# EAGLE design TPS (EAGLE 9.6.2)
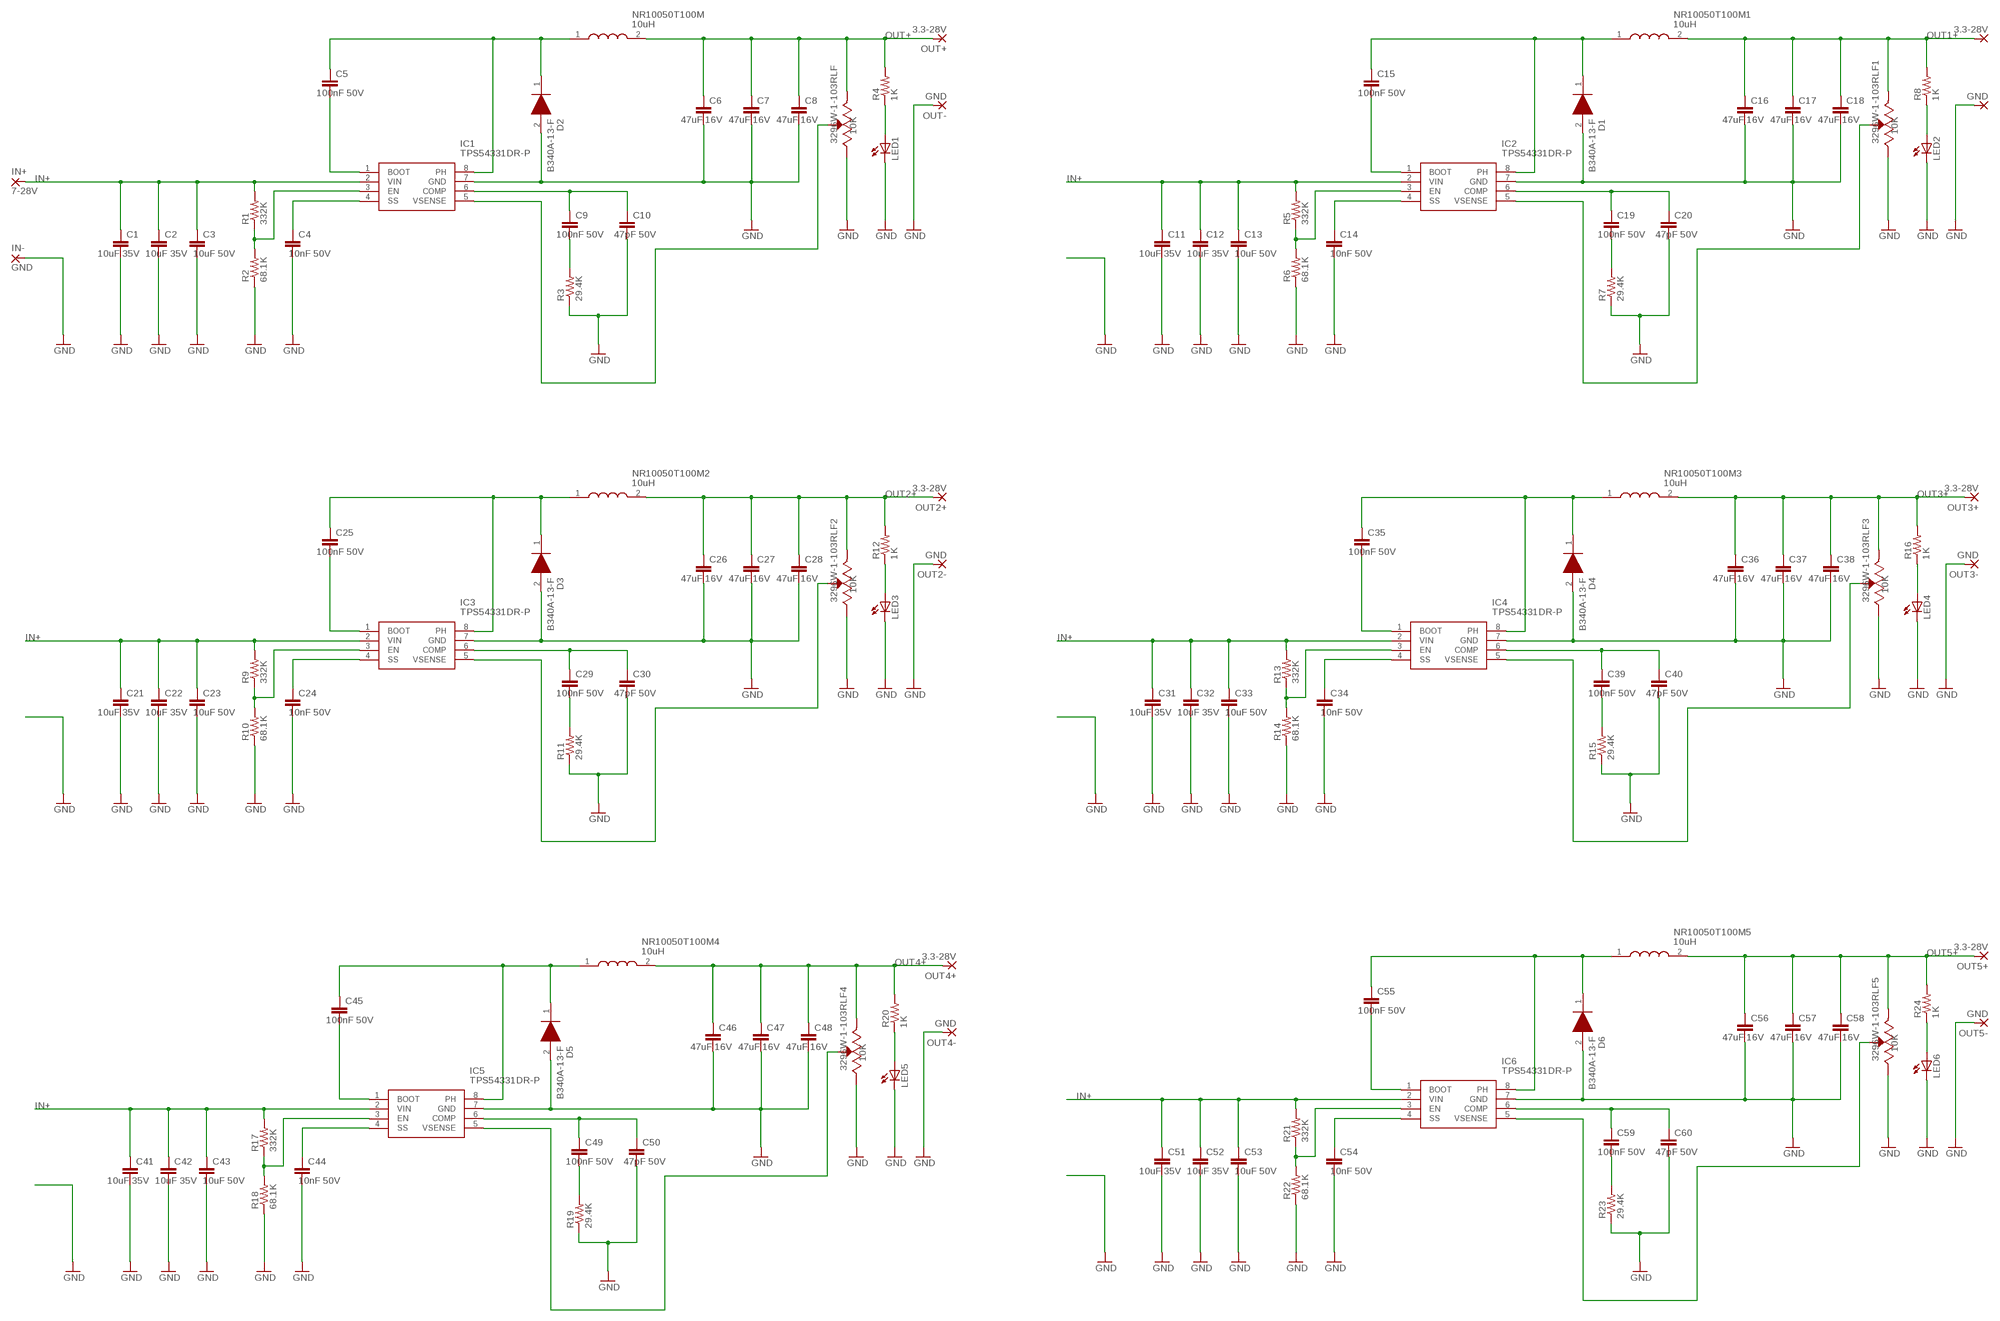
[diagram p0: schematic, sheet 1]

## Parts
3296W-1-103RLF  10K  3296W-1-103RLF  [TRIM_3296W-1-103RLF]
3296W-1-103RLF1  10K  3296W-1-103RLF  [TRIM_3296W-1-103RLF]
3296W-1-103RLF2  10K  3296W-1-103RLF  [TRIM_3296W-1-103RLF]
3296W-1-103RLF3  10K  3296W-1-103RLF  [TRIM_3296W-1-103RLF]
3296W-1-103RLF4  10K  3296W-1-103RLF  [TRIM_3296W-1-103RLF]
3296W-1-103RLF5  10K  3296W-1-103RLF  [TRIM_3296W-1-103RLF]
C1  10uF 35V  SPARKFUN_CAP1206  [SPARKFUN_1206]
C2  10uF 35V  SPARKFUN_CAP1206  [SPARKFUN_1206]
C3  10uF 50V  CAP1206  [1206]
C4  10nF 50V  SPARKFUN_CAP1206  [SPARKFUN_1206]
C5  100nF 50V  SPARKFUN_CAP1206  [SPARKFUN_1206]
C6  47uF 16V  SPARKFUN_CAP1206  [SPARKFUN_1206]
C7  47uF 16V  SPARKFUN_CAP1206  [SPARKFUN_1206]
C8  47uF 16V  SPARKFUN_CAP1206  [SPARKFUN_1206]
C9  100nF 50V  SPARKFUN_CAP1206  [SPARKFUN_1206]
C10  47pF 50V  SPARKFUN_CAP1206  [SPARKFUN_1206]
C11  10uF 35V  SPARKFUN_CAP1206  [SPARKFUN_1206]
C12  10uF 35V  SPARKFUN_CAP1206  [SPARKFUN_1206]
C13  10uF 50V  CAP1206  [1206]
C14  10nF 50V  SPARKFUN_CAP1206  [SPARKFUN_1206]
C15  100nF 50V  SPARKFUN_CAP1206  [SPARKFUN_1206]
C16  47uF 16V  SPARKFUN_CAP1206  [SPARKFUN_1206]
C17  47uF 16V  SPARKFUN_CAP1206  [SPARKFUN_1206]
C18  47uF 16V  SPARKFUN_CAP1206  [SPARKFUN_1206]
C19  100nF 50V  SPARKFUN_CAP1206  [SPARKFUN_1206]
C20  47pF 50V  SPARKFUN_CAP1206  [SPARKFUN_1206]
C21  10uF 35V  SPARKFUN_CAP1206  [SPARKFUN_1206]
C22  10uF 35V  SPARKFUN_CAP1206  [SPARKFUN_1206]
C23  10uF 50V  CAP1206  [1206]
C24  10nF 50V  SPARKFUN_CAP1206  [SPARKFUN_1206]
C25  100nF 50V  SPARKFUN_CAP1206  [SPARKFUN_1206]
C26  47uF 16V  SPARKFUN_CAP1206  [SPARKFUN_1206]
C27  47uF 16V  SPARKFUN_CAP1206  [SPARKFUN_1206]
C28  47uF 16V  SPARKFUN_CAP1206  [SPARKFUN_1206]
C29  100nF 50V  SPARKFUN_CAP1206  [SPARKFUN_1206]
C30  47pF 50V  SPARKFUN_CAP1206  [SPARKFUN_1206]
C31  10uF 35V  SPARKFUN_CAP1206  [SPARKFUN_1206]
C32  10uF 35V  SPARKFUN_CAP1206  [SPARKFUN_1206]
C33  10uF 50V  CAP1206  [1206]
C34  10nF 50V  SPARKFUN_CAP1206  [SPARKFUN_1206]
C35  100nF 50V  SPARKFUN_CAP1206  [SPARKFUN_1206]
C36  47uF 16V  SPARKFUN_CAP1206  [SPARKFUN_1206]
C37  47uF 16V  SPARKFUN_CAP1206  [SPARKFUN_1206]
C38  47uF 16V  SPARKFUN_CAP1206  [SPARKFUN_1206]
C39  100nF 50V  SPARKFUN_CAP1206  [SPARKFUN_1206]
C40  47pF 50V  SPARKFUN_CAP1206  [SPARKFUN_1206]
C41  10uF 35V  SPARKFUN_CAP1206  [SPARKFUN_1206]
C42  10uF 35V  SPARKFUN_CAP1206  [SPARKFUN_1206]
C43  10uF 50V  CAP1206  [1206]
C44  10nF 50V  SPARKFUN_CAP1206  [SPARKFUN_1206]
C45  100nF 50V  SPARKFUN_CAP1206  [SPARKFUN_1206]
C46  47uF 16V  SPARKFUN_CAP1206  [SPARKFUN_1206]
C47  47uF 16V  SPARKFUN_CAP1206  [SPARKFUN_1206]
C48  47uF 16V  SPARKFUN_CAP1206  [SPARKFUN_1206]
C49  100nF 50V  SPARKFUN_CAP1206  [SPARKFUN_1206]
C50  47pF 50V  SPARKFUN_CAP1206  [SPARKFUN_1206]
C51  10uF 35V  SPARKFUN_CAP1206  [SPARKFUN_1206]
C52  10uF 35V  SPARKFUN_CAP1206  [SPARKFUN_1206]
C53  10uF 50V  CAP1206  [1206]
C54  10nF 50V  SPARKFUN_CAP1206  [SPARKFUN_1206]
C55  100nF 50V  SPARKFUN_CAP1206  [SPARKFUN_1206]
C56  47uF 16V  SPARKFUN_CAP1206  [SPARKFUN_1206]
C57  47uF 16V  SPARKFUN_CAP1206  [SPARKFUN_1206]
C58  47uF 16V  SPARKFUN_CAP1206  [SPARKFUN_1206]
C59  100nF 50V  SPARKFUN_CAP1206  [SPARKFUN_1206]
C60  47pF 50V  SPARKFUN_CAP1206  [SPARKFUN_1206]
D1  B340A-13-F  [DIOM5226X240N]
D2  B340A-13-F  [DIOM5226X240N]
D3  B340A-13-F  [DIOM5226X240N]
D4  B340A-13-F  [DIOM5226X240N]
D5  B340A-13-F  [DIOM5226X240N]
D6  B340A-13-F  [DIOM5226X240N]
IC1  TPS54331DR-P  [SOIC127P600X175-8N]
IC2  TPS54331DR-P  [SOIC127P600X175-8N]
IC3  TPS54331DR-P  [SOIC127P600X175-8N]
IC4  TPS54331DR-P  [SOIC127P600X175-8N]
IC5  TPS54331DR-P  [SOIC127P600X175-8N]
IC6  TPS54331DR-P  [SOIC127P600X175-8N]
IN+  7-28V  WIREPADSMD5-2,5  [5-2,5]
IN-  GND  WIREPAD3,81/1,4  [3,81/1,4]
LED1  SPARKFUN_LED1206  [SPARKFUN_LED-1206]
LED2  SPARKFUN_LED1206  [SPARKFUN_LED-1206]
LED3  SPARKFUN_LED1206  [SPARKFUN_LED-1206]
LED4  SPARKFUN_LED1206  [SPARKFUN_LED-1206]
LED5  SPARKFUN_LED1206  [SPARKFUN_LED-1206]
LED6  SPARKFUN_LED1206  [SPARKFUN_LED-1206]
NR10050T100M  10uH  NR10050T100M  [NR10050T100M]
NR10050T100M1  10uH  NR10050T100M  [NR10050T100M]
NR10050T100M2  10uH  NR10050T100M  [NR10050T100M]
NR10050T100M3  10uH  NR10050T100M  [NR10050T100M]
NR10050T100M4  10uH  NR10050T100M  [NR10050T100M]
NR10050T100M5  10uH  NR10050T100M  [NR10050T100M]
OUT1+  3.3-28V  WIREPADSMD5-2,5  [5-2,5]
OUT1-  GND  WIREPAD3,81/1,4  [3,81/1,4]
OUT2+  3.3-28V  WIREPADSMD5-2,5  [5-2,5]
OUT2-  GND  WIREPAD3,81/1,4  [3,81/1,4]
OUT3+  3.3-28V  WIREPADSMD5-2,5  [5-2,5]
OUT3-  GND  WIREPAD3,81/1,4  [3,81/1,4]
OUT4+  3.3-28V  WIREPADSMD5-2,5  [5-2,5]
OUT4-  GND  WIREPAD3,81/1,4  [3,81/1,4]
OUT5+  3.3-28V  WIREPADSMD5-2,5  [5-2,5]
OUT5-  GND  WIREPAD3,81/1,4  [3,81/1,4]
OUT+  3.3-28V  WIREPADSMD5-2,5  [5-2,5]
OUT-  GND  WIREPAD3,81/1,4  [3,81/1,4]
R1  332K  R-US_M1206  [M1206]
R2  68.1K  R-US_M1206  [M1206]
R3  29.4K  R-US_M1206  [M1206]
R4  1K  R-US_M1206  [M1206]
R5  332K  R-US_M1206  [M1206]
R6  68.1K  R-US_M1206  [M1206]
R7  29.4K  R-US_M1206  [M1206]
R8  1K  R-US_M1206  [M1206]
R9  332K  R-US_M1206  [M1206]
R10  68.1K  R-US_M1206  [M1206]
R11  29.4K  R-US_M1206  [M1206]
R12  1K  R-US_M1206  [M1206]
R13  332K  R-US_M1206  [M1206]
R14  68.1K  R-US_M1206  [M1206]
R15  29.4K  R-US_M1206  [M1206]
R16  1K  R-US_M1206  [M1206]
R17  332K  R-US_M1206  [M1206]
R18  68.1K  R-US_M1206  [M1206]
R19  29.4K  R-US_M1206  [M1206]
R20  1K  R-US_M1206  [M1206]
R21  332K  R-US_M1206  [M1206]
R22  68.1K  R-US_M1206  [M1206]
R23  29.4K  R-US_M1206  [M1206]
R24  1K  R-US_M1206  [M1206]

## Nets
GND: 3296W-1-103RLF1.1(CCW) 3296W-1-103RLF2.1(CCW) 3296W-1-103RLF3.1(CCW) 3296W-1-103RLF4.1(CCW) 3296W-1-103RLF5.1(CCW) 3296W-1-103RLF.1(CCW) C1.2 C2.2 C3.2 C4.2 C6.2 C7.2 C8.2 C10.2 C11.2 C12.2 C13.2 C14.2 C16.2 C17.2 C18.2 C20.2 C21.2 C22.2 C23.2 C24.2 C26.2 C27.2 C28.2 C30.2 C31.2 C32.2 C33.2 C34.2 C36.2 C37.2 C38.2 C40.2 C41.2 C42.2 C43.2 C44.2 C46.2 C47.2 C48.2 C50.2 C51.2 C52.2 C53.2 C54.2 C56.2 C57.2 C58.2 C60.2 D1.2(A) D2.2(A) D3.2(A) D4.2(A) D5.2(A) D6.2(A) IC1.7(GND) IC2.7(GND) IC3.7(GND) IC4.7(GND) IC5.7(GND) IC6.7(GND) IN-.1(P) LED1.C LED2.C LED3.C LED4.C LED5.C LED6.C OUT1-.1(P) OUT2-.1(P) OUT3-.1(P) OUT4-.1(P) OUT5-.1(P) OUT-.1(P) R2.1 R3.1 R6.1 R7.1 R10.1 R11.1 R14.1 R15.1 R18.1 R19.1 R22.1 R23.1
IN+: C1.1 C2.1 C3.1 C11.1 C12.1 C13.1 C21.1 C22.1 C23.1 C31.1 C32.1 C33.1 C41.1 C42.1 C43.1 C51.1 C52.1 C53.1 IC1.2(VIN) IC2.2(VIN) IC3.2(VIN) IC4.2(VIN) IC5.2(VIN) IC6.2(VIN) IN+.1(P) R1.2 R5.2 R9.2 R13.2 R17.2 R21.2
N$1: IC1.3(EN) R1.1 R2.2
N$3: C4.1 IC1.4(SS)
N$4: C5.2 IC1.1(BOOT)
N$5: C5.1 D2.1(K) IC1.8(PH) NR10050T100M.1
N$6: C9.1 C10.1 IC1.6(COMP)
N$8: C9.2 R3.2
N$9: IC2.3(EN) R5.1 R6.2
N$10: LED1.A R4.1
N$11: 3296W-1-103RLF.2(WIPER) IC1.5(VSENSE)
N$13: C14.1 IC2.4(SS)
N$14: C15.2 IC2.1(BOOT)
N$15: C15.1 D1.1(K) IC2.8(PH) NR10050T100M1.1
N$17: C19.1 C20.1 IC2.6(COMP)
N$18: C19.2 R7.2
N$19: LED2.A R8.1
N$20: 3296W-1-103RLF1.2(WIPER) IC2.5(VSENSE)
N$21: IC3.3(EN) R9.1 R10.2
N$23: C24.1 IC3.4(SS)
N$24: C25.2 IC3.1(BOOT)
N$25: C25.1 D3.1(K) IC3.8(PH) NR10050T100M2.1
N$27: C29.1 C30.1 IC3.6(COMP)
N$28: C29.2 R11.2
N$29: LED3.A R12.1
N$30: 3296W-1-103RLF2.2(WIPER) IC3.5(VSENSE)
N$31: IC4.3(EN) R13.1 R14.2
N$33: C34.1 IC4.4(SS)
N$34: C35.2 IC4.1(BOOT)
N$35: C35.1 D4.1(K) IC4.8(PH) NR10050T100M3.1
N$37: C39.1 C40.1 IC4.6(COMP)
N$38: C39.2 R15.2
N$39: LED4.A R16.1
N$40: 3296W-1-103RLF3.2(WIPER) IC4.5(VSENSE)
N$41: IC5.3(EN) R17.1 R18.2
N$43: C44.1 IC5.4(SS)
N$44: C45.2 IC5.1(BOOT)
N$45: C45.1 D5.1(K) IC5.8(PH) NR10050T100M4.1
N$47: C49.1 C50.1 IC5.6(COMP)
N$48: C49.2 R19.2
N$49: LED5.A R20.1
N$50: 3296W-1-103RLF4.2(WIPER) IC5.5(VSENSE)
N$51: IC6.3(EN) R21.1 R22.2
N$53: C54.1 IC6.4(SS)
N$54: C55.2 IC6.1(BOOT)
N$55: C55.1 D6.1(K) IC6.8(PH) NR10050T100M5.1
N$57: C59.1 C60.1 IC6.6(COMP)
N$58: C59.2 R23.2
N$59: LED6.A R24.1
N$60: 3296W-1-103RLF5.2(WIPER) IC6.5(VSENSE)
OUT1+: 3296W-1-103RLF1.3(CW) C16.1 C17.1 C18.1 NR10050T100M1.2 OUT1+.1(P) R8.2
OUT2+: 3296W-1-103RLF2.3(CW) C26.1 C27.1 C28.1 NR10050T100M2.2 OUT2+.1(P) R12.2
OUT3+: 3296W-1-103RLF3.3(CW) C36.1 C37.1 C38.1 NR10050T100M3.2 OUT3+.1(P) R16.2
OUT4+: 3296W-1-103RLF4.3(CW) C46.1 C47.1 C48.1 NR10050T100M4.2 OUT4+.1(P) R20.2
OUT5+: 3296W-1-103RLF5.3(CW) C56.1 C57.1 C58.1 NR10050T100M5.2 OUT5+.1(P) R24.2
OUT+: 3296W-1-103RLF.3(CW) C6.1 C7.1 C8.1 NR10050T100M.2 OUT+.1(P) R4.2

## Library data of the parts
3296W-1-103RLF 3296W-1-103RLF1-3296W-1-103RLF5 = 3296W-1-103RLF:3296W-1-103RLF: Res Cermet Trimmer 500K Ohm 10% 0.5W 25(Elec)Turn 2.19mm (9.53 X 4.83 X 11.55mm) Pin Thru-Hole Tube Check prices <https://pricing.snapeda.com/parts/3296W-1-103RLF/Bourns/view-part?ref=eda>; AVAILABILITY: In Stock; DESCRIPTION: 10 kOhms 0.5W, 1/2W PC Pins Through Hole Trimmer Potentiometer Cermet 25 Turn Top Adjustment; MF: Bourns; MP: 3296W-1-103RLF; PACKAGE: SOT-23-5 Bourns; PRICE: None; PURCHASE-URL: https://pricing.snapeda.com/search/part/3296W-1-103RLF/?ref=eda
C1 C2 C4-C12 C14-C22 C24-C32 C34-C42 C44-C52 C54-C60 = DECADE-libraries20151104:SPARKFUN_CAP: Capacitor Standard 0603 ceramic capacitor, and 0.1" leaded capacitor.
C3 C13 C23 C33 C43 C53 = SparkFun:CAP: Capacitor Standard 0603 ceramic capacitor, and 0.1" leaded capacitor.
D1-D6 = B340A-13-F:B340A-13-F: Schottky Diode 3A 40V 0.5Vf SMA Diodes Inc B340A-13-F, SMT Schottky Diode, 40V 3A, 2-Pin DO-214AC Source: Datasheet <http://www.diodes.com/_files/datasheets/ds30891.pdf>; ARROW_PART_NUMBER: B340A-13-F; ARROW_PRICE-STOCK: https://www.arrow.com/en/products/b340a-13-f/diodes-incorporated?region=nac; DESCRIPTION: Schottky Diode 3A 40V 0.5Vf SMA Diodes Inc B340A-13-F, SMT Schottky Diode, 40V 3A, 2-Pin DO-214AC; HEIGHT: 2.4mm; MANUFACTURER_NAME: Diodes Inc.; MANUFACTURER_PART_NUMBER: B340A-13-F; MOUSER_PART_NUMBER: 621-B340A-F; MOUSER_PRICE-STOCK: https://www.mouser.co.uk/ProductDetail/Diodes-Incorporated/B340A-13-F?qs=aLaTXeBcTP9fj%2FYKVo6Q1A%3D%3D
IC1-IC6 = TPS54331DR-P:TPS54331DR-P: 3.5V to 28V Input, 3A, 570kHz Step-Down Converter with Eco-mode Source: Datasheet <https://www.ti.com/lit/ds/symlink/tps54331.pdf?ts=1630984381275>; DESCRIPTION: 3.5V to 28V Input, 3A, 570kHz Step-Down Converter with Eco-mode; HEIGHT: 1.75mm; MANUFACTURER_NAME: Texas Instruments; MANUFACTURER_PART_NUMBER: TPS54331DR-P
IN+ IN- OUT1+ OUT1- OUT2+ OUT2- OUT3+ OUT3- OUT4+ OUT4- OUT5+ OUT5- OUT+ OUT- = wirepad:WIREPAD: Wire PAD connect wire on PCB
LED1-LED6 = antduino:SPARKFUN_LED: LEDs Standard schematic elements and footprints for 5mm, 3mm, 1206, and 0603 sized LEDs. 5mm - Spark Fun Electronics SKU : COM-00529 (and others)
NR10050T100M NR10050T100M1-NR10050T100M5 = NR10050T100M:NR10050T100M: NR10050T100M Source: Datasheet <https://ds.yuden.co.jp/TYCOMPAS/ut/download?pn=NRH2412T4R7MNGH &fileType=CA>; ARROW_PART_NUMBER: NR10050T100M; ARROW_PRICE-STOCK: https://www.arrow.com/en/products/nr10050t100m/taiyo-yuden; DESCRIPTION: NR10050T100M; HEIGHT: 5mm; MANUFACTURER_NAME: TAIYO YUDEN; MANUFACTURER_PART_NUMBER: NR10050T100M; MOUSER_PART_NUMBER: 963-NR10050T100M; MOUSER_PRICE-STOCK: https://www.mouser.co.uk/ProductDetail/Taiyo-Yuden/NR10050T100M?qs=PzICbMaShUe7rvK%2FGqf0eQ%3D%3D
R1-R24 = adafruit:R-US_: RESISTOR, American symbol

## Board
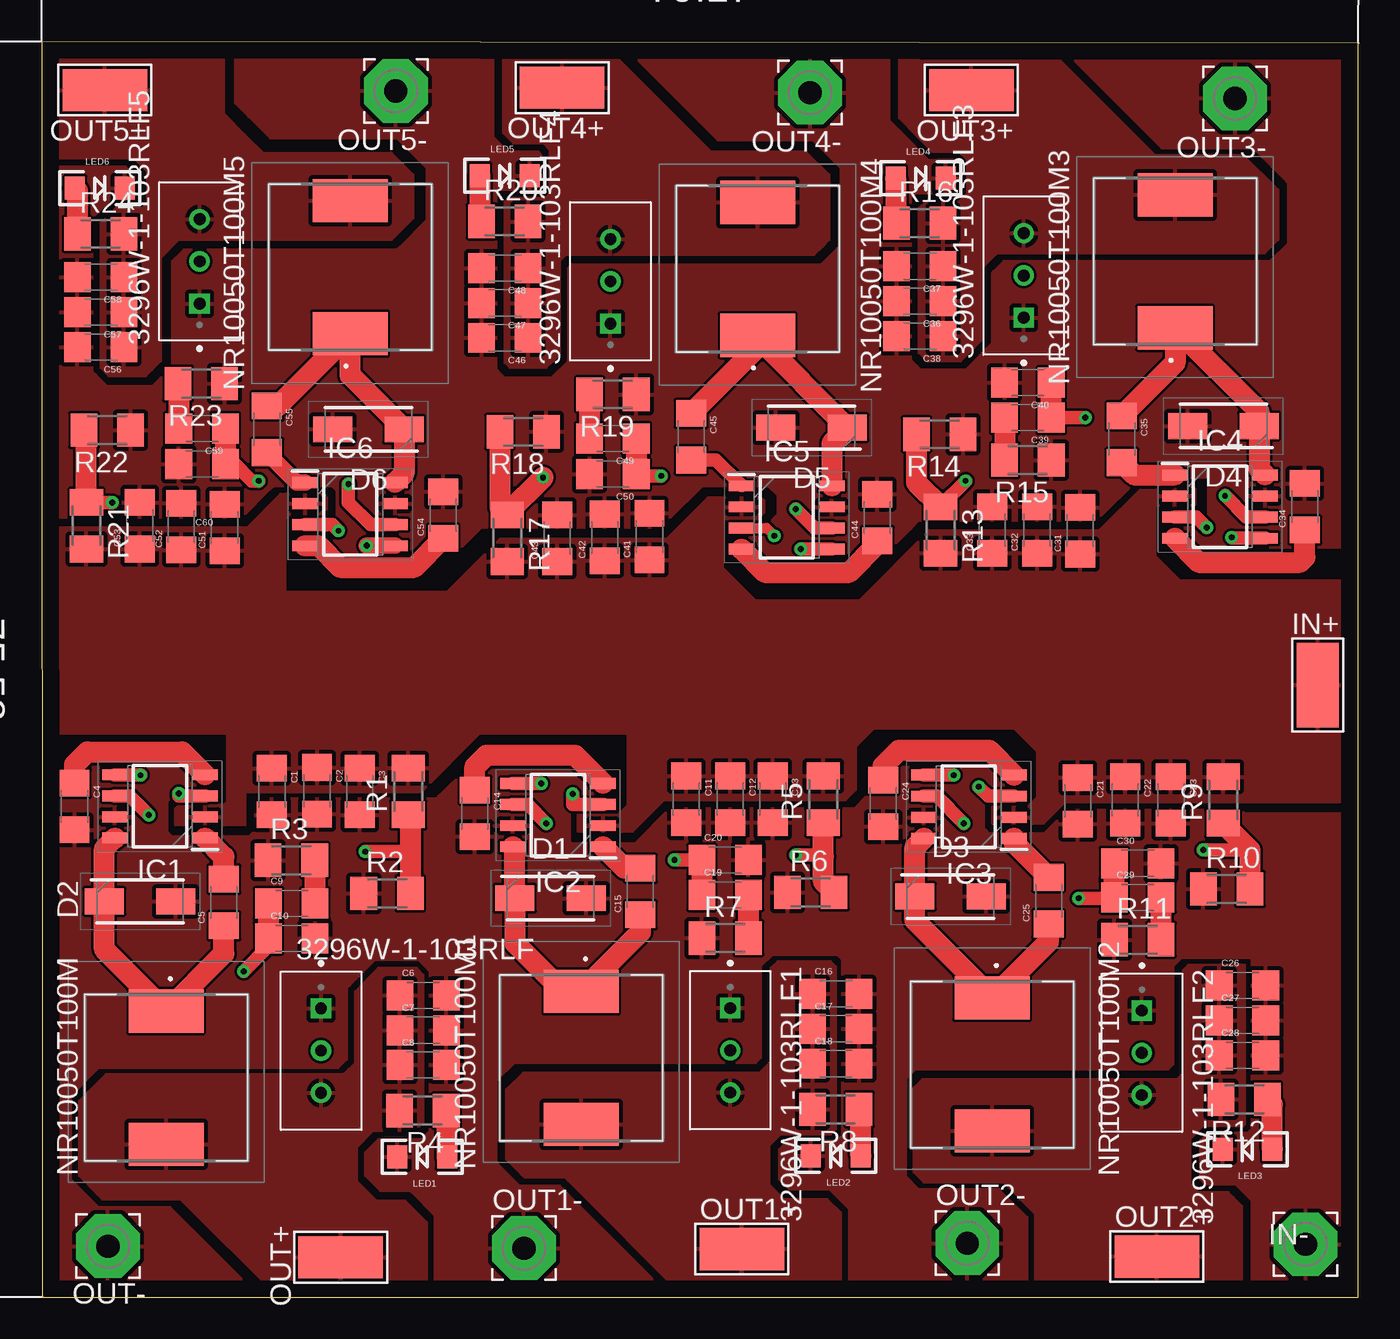
[diagram p1: board, top side]
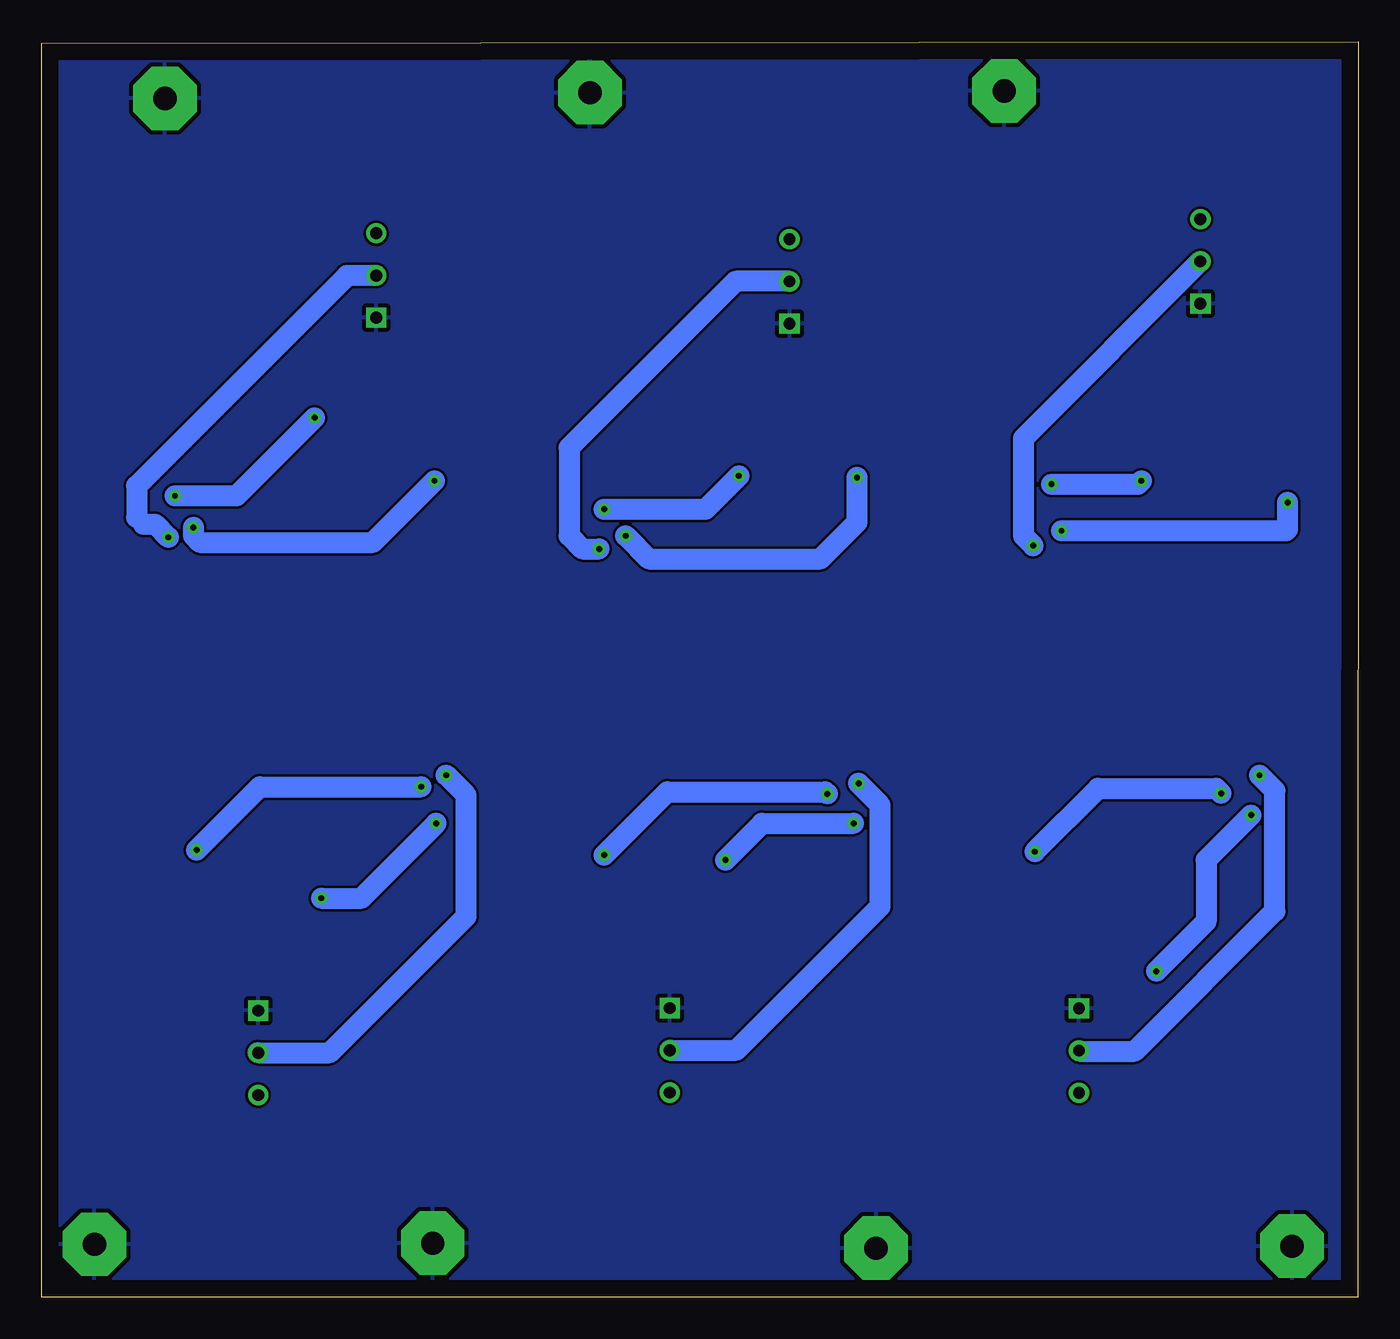
[diagram p2: board, bottom side, seen from below]

Size 79.17 x 75.52 mm. Coordinates in mm from the lower left corner, seen from the top.
Outline: 0.05,0 79.17,0 79.17,75.42 0,75.52 0.05,0
Copper layers (1*16): Top 0.035mm / dielectric 1.5mm / Bottom 0.035mm
Design rules "default": minimum track width 6mil, minimum drill 0.35mm, track to track 6mil, track to pad 6mil, pad to pad 6mil, via to via 6mil, smd to smd 6mil, copper to edge 40mil, drill to drill 6mil, minimum pad ring 10mil, minimum via ring 8mil, stop-mask expansion 4mil, vias tented up to drill 0mil, thermal gap 10mil

### Footprints (pad centres in the part's own frame; a part is rotated, then mirrored left to right if it is on the bottom)
TRIM_3296W-1-103RLF = drill 0.71 square: 1 -2.54,0 | drill 0.71: 2 0,0; 3 2.54,0
SPARKFUN_1206 = smd 1.6 x 1.8: 1 -1.4,0; 2 1.4,0
1206 = smd 1.6 x 1.8: 1 -1.4,0; 2 1.4,0
DIOM5226X240N = smd 2.35 x 1.55: 1 -2.15,0; 2 2.15,0
SOIC127P600X175-8N = smd 1.528 x 0.65: 1 -2.711,1.905; 2 -2.711,0.635; 3 -2.711,-0.635; 4 -2.711,-1.905; 5 2.711,-1.905; 6 2.711,-0.635; 7 2.711,0.635; 8 2.711,1.905
5-2,5 = smd 2.54 x 5.08: 1 0,0
3,81/1,4 = drill 1.397 pad 3.81 octagon: 1 0,0
SPARKFUN_LED-1206 = smd 1.2 x 1.4: A -1.5,0; C 1.5,0
NR10050T100M = smd 2.6 x 4.5: 1 -4,0; 2 4,0
M1206 = smd 1.6 x 2: 1 -1.4,0; 2 1.4,0

### Placement (x,y rotation side)
3296W-1-103RLF  16.8,14.83 270 top
3296W-1-103RLF1  41.4,14.85 270 top
3296W-1-103RLF2  66.15,14.7 270 top
3296W-1-103RLF3  59.05,61.45 90 top
3296W-1-103RLF4  34.2,61.1 90 top
3296W-1-103RLF5  9.5,62.3 90 top
C1  13.85,30.41 270 top
C2  16.56,30.46 270 top
C3  19.12,30.41 270 top
C4  1.98,29.51 270 top
C5  10.96,23.74 90 top
C6  22.94,18.15 0 top
C7  22.94,16.06 0 top
C8  22.94,13.97 0 top
C9  15.04,23.68 0 top
C10  15.04,21.59 0 top
C11  38.75,29.95 270 top
C12  41.4,29.95 270 top
C13  43.95,29.95 270 top
C14  26.05,29.1 270 top
C15  36,24.4 90 top
C16  47.75,18.25 0 top
C17  47.75,16.15 0 top
C18  47.75,14.05 0 top
C19  41.1,24.2 0 top
C20  41.1,26.3 0 top
C21  62.3,29.85 270 top
C22  65.15,29.9 270 top
C23  67.9,29.9 270 top
C24  50.6,29.7 270 top
C25  60.55,23.85 90 top
C26  72.2,18.75 0 top
C27  72.2,16.65 0 top
C28  72.2,14.55 0 top
C29  65.9,24.05 0 top
C30  65.9,26.1 0 top
C31  62.45,46.1 90 top
C32  59.85,46.15 90 top
C33  57.15,46.15 90 top
C34  75.95,47.55 90 top
C35  64.95,51.6 270 top
C36  52.8,59.9 180 top
C37  52.8,62 180 top
C38  52.8,57.8 180 top
C39  59.3,52.9 180 top
C40  59.3,55 180 top
C41  36.55,45.75 90 top
C42  33.85,45.7 90 top
C43  31,45.65 90 top
C44  50.25,46.9 90 top
C45  39.05,51.75 270 top
C46  27.85,57.7 180 top
C47  27.85,59.8 180 top
C48  27.85,61.9 180 top
C49  34.35,51.65 180 top
C50  34.35,49.5 180 top
C51  11,46.3 90 top
C52  8.4,46.35 90 top
C53  5.9,46.4 90 top
C54  24.15,47.05 90 top
C55  13.55,52.2 270 top
C56  3.55,57.15 180 top
C57  3.55,59.25 180 top
C58  3.55,61.35 180 top
C59  9.65,52.25 180 top
C60  9.65,50.1 180 top
D1  30.6,24 0 top
D2  5.92,23.8 0 top
D3  54.65,24.1 0 top
D4  71.05,52.4 180 top
D5  46.3,52.3 180 top
D6  19.65,52.2 180 top
IC1  7.12,29.52 180 top
IC2  31.05,29 180 top
IC3  55.75,29.5 180 top
IC4  70.85,47.55 0 top
IC5  44.8,46.9 0 top
IC6  18.55,47.1 0 top
IN+  76.73,36.82 0 top
IN-  75.99,3.18 180 top
LED1  22.88,8.44 180 top
LED2  47.75,8.5 180 top
LED3  72.5,8.9 180 top
LED4  52.85,67.3 0 top
LED5  27.85,67.45 0 top
LED6  3.5,66.7 0 top
NR10050T100M  7.49,13.2 270 top
NR10050T100M1  32.45,14.4 270 top
NR10050T100M2  57.15,14 270 top
NR10050T100M3  68.15,62.3 90 top
NR10050T100M4  43.05,61.85 90 top
NR10050T100M5  18.55,61.95 90 top
OUT1+  42.1,2.9 270 top
OUT1-  29,2.95 0 top
OUT2+  67.05,2.45 270 top
OUT2-  55.65,3.25 0 top
OUT3+  55.9,72.6 90 top
OUT3-  71.75,72.1 180 top
OUT4+  31.3,72.75 90 top
OUT4-  46.2,72.45 180 top
OUT5+  3.8,72.6 90 top
OUT5-  21.3,72.55 180 top
OUT+  17.98,2.4 90 top
OUT-  3.99,3.07 0 top
R1  22.05,30.42 90 top
R2  20.77,24.29 0 top
R3  15.02,26.28 0 top
R4  22.93,11.23 180 top
R5  47,29.95 90 top
R6  46.25,24.35 0 top
R7  41.1,21.6 0 top
R8  47.75,11.3 180 top
R9  71.05,29.9 90 top
R10  71.25,24.55 0 top
R11  65.9,21.5 0 top
R12  72.3,11.9 180 top
R13  54.05,46.15 270 top
R14  54,51.9 180 top
R15  59.3,50.35 180 top
R16  52.8,64.6 0 top
R17  28,45.65 270 top
R18  28.95,52.05 180 top
R19  34.35,54.3 180 top
R20  27.85,64.7 0 top
R21  2.7,46.4 270 top
R22  3.95,52.15 180 top
R23  9.6,54.95 180 top
R24  3.55,63.95 0 top

### Tracks (layer width: path | path; a pad name or v marks a point on that pad's centre or on a via)
GND
  pour Bottom: -1.15,76.5 -1.15,-1 -0.95,-1.2 79.95,-1.2 80.35,-0.8 80.35,76.1 79.05,77.4 -0.25,77.4
  pour Top: 79.15,45.1 68.15,45.1 68.15,46.4 68.45,46.7 70.05,46.7 70.15,46.8 70.15,49.3 66.05,49.3 63.45,46.7 56.75,46.7 52.75,46.7 52.25,46.2 50.35,44.3 42.05,44.3 41.85,44.5 41.85,46.1 43.25,46.1 44.25,47.1 44.25,48.2 43.65,48.8 40.05,48.8 39.75,48.8 37.75,46.8 37.65,46.7 37.65,46.5 37.45,46.3 26.75,46.3 26.45,46.3 24.65,44.5 24.15,44.5 15.45,44.5 15.45,46.6 17.25,46.6 17.55,46.9 17.75,47.1 17.75,48.5 17.45,48.8 17.05,48.8 13.95,48.8 13.75,48.6 12.05,46.9 0.35,46.9 0.25,46.9 0.05,47.1 0.05,67.8 0.25,68 5.05,68 5.55,67.5 5.55,66.8 5.55,66.1 5.45,66 5.05,66 4.15,66 3.05,64.9 3.05,64.8 3.05,55.7 3.25,55.5 3.95,54.8 6.65,54.8 7.15,55.3 7.85,56 7.85,56.6 7.85,62.3 8.05,62.5 8.55,63 8.85,63 21.35,63 21.55,63.2 23.15,64.8 23.15,64.9 23.15,67.9 21.35,69.7 21.05,69.7 13.75,69.7 12.45,71 11.65,71.8 11.65,75.5 27.05,75.5 27.15,75.4 27.15,69.8 28.05,68.9 29.85,68.9 30.05,68.7 30.05,66.7 29.95,66.6 27.55,66.6 27.35,66.4 27.35,55.8 27.45,55.7 27.85,55.3 30.65,55.3 31.65,56.3 31.65,56.4 31.65,61.9 31.85,62.1 46.85,62.1 48.05,63.3 48.05,67.9 46.35,69.6 45.85,69.6 40.65,69.6 39.55,70.7 34.95,75.3 34.95,75.6 50.65,75.6 50.95,75.3 50.95,70.8 51.65,70.1 53.35,68.4 53.45,68.4 54.85,68.4 54.95,68.4 55.15,68.2 55.15,66.6 54.95,66.4 52.55,66.4 52.25,66.1 52.25,56.4 52.65,56 52.85,55.8 55.55,55.8 57.15,57.4 57.15,57.5 57.15,61.6 57.25,61.7 57.85,62.3 58.75,62.3 73.85,62.3 74.95,63.4 74.95,67 74.85,67.1 72.85,69.1 72.35,69.1 67.35,69.1 61.45,75 61.15,75 61.05,75.1 61.05,75.4 61.15,75.5 61.65,75.5 79.05,75.5 79.15,75.4
  pour Top: 79.25,29.1 72.35,29.1 72.15,29.3 61.65,29.3 61.35,29 60.25,27.9 59.95,27.9 56.95,27.9 56.75,28.1 56.65,28.2 56.65,29.6 56.65,29.7 56.95,30 58.75,30 59.05,30.3 59.05,31.6 58.75,31.9 57.65,31.9 49.95,31.9 49.65,31.9 49.65,30.4 49.65,30.2 48.85,29.4 37.75,29.4 35.65,27.3 35.05,27.3 31.85,27.3 31.75,27.4 31.75,29.3 31.95,29.5 34.25,29.5 34.35,29.6 34.35,30.7 34.35,31.7 34.25,31.8 25.55,31.8 23.95,30.2 23.75,30 12.95,30 12.85,29.9 12.85,28.1 12.45,27.7 7.85,27.7 7.55,28 7.55,29.8 7.85,30.1 9.35,30.1 10.35,30.1 10.45,30.2 10.45,31.7 10.25,31.9 0.05,31.9 0.05,0 13.15,0 7.75,5.4 7.55,5.4 3.45,5.4 1.75,7.1 1.75,7.2 1.75,12.1 1.95,12.3 3.45,13.8 17.85,13.8 18.35,14.3 18.35,14.5 18.35,18.6 18.55,18.8 20.05,20.3 20.95,20.3 22.65,20.3 23.25,19.7 23.35,19.6 23.35,10.5 23.35,10 22.85,9.5 20.25,9.5 19.45,8.7 19.45,7.3 20.35,6.4 22.15,6.4 22.25,6.3 23.65,4.9 23.65,3.7 23.65,0 37.85,0 31.15,6.7 29.05,6.7 28.75,6.7 27.35,8.1 27.35,13 28.45,14.1 42.95,14.1 43.25,14.4 43.25,19.9 43.95,20.6 47.85,20.6 48.05,20.4 48.15,20.3 48.15,9.7 47.95,9.5 47.85,9.4 45.25,9.4 44.85,9.4 44.35,8.9 44.35,7.1 44.95,6.5 45.55,6.5 47.35,6.5 48.55,5.3 48.55,0 59.25,0 59.25,4.8 57.55,6.5 52.75,6.5 51.95,7.3 51.95,13.1 52.25,13.4 52.55,13.7 55.55,13.7 67.75,13.7 68.05,14 68.05,19.9 68.55,20.4 72.65,20.4 72.75,20.3 72.75,10.1 72.65,10 72.55,9.9 70.15,9.9 69.65,9.4 69.65,8.3 69.65,7.1 69.85,6.9 69.95,6.8 71.45,6.8 71.75,6.8 72.75,5.8 72.75,5 72.75,0 79.15,0 79.15,29
IN+
  pour Top: 79.15,29.8 61.55,29.8 60.25,28.5 57.15,28.5 57.15,29.5 59.25,29.5 59.85,30.1 59.85,32.8 58.45,34.2 50.05,34.2 48.95,33.1 48.95,30.5 48.35,29.9 37.45,29.9 35.55,28 32.25,28 32.25,29 34.65,29 35.25,29.6 35.25,33.9 26.35,33.9 22.85,30.4 12.25,30.4 12.25,28.4 8.05,28.4 8.05,29.4 8.25,29.6 10.95,29.6 11.15,29.8 11.15,33.9 0.35,33.9 0.35,45.8 0.85,46.3 12.35,46.3 14.35,48.3 16.95,48.3 17.15,48.1 17.15,47.4 16.85,47.1 14.95,47.1 14.65,46.8 14.65,42.4 24.35,42.4 27.55,45.6 37.55,45.6 40.05,48.1 43.25,48.1 43.45,47.9 43.45,47.2 43.05,46.8 40.95,46.8 40.95,43.9 42.95,41.9 49.15,41.9 53.35,46.1 63.55,46.1 66.25,48.8 69.15,48.8 69.35,48.6 69.35,47.7 69.25,47.6 66.95,47.6 66.95,44.6 68.45,43.1 79.15,43.1
N$1  (via drill 0.35)
  Top 0.8: IC1.3 8.25,30.16 v8.25,30.3 | v19.45,26.8 22.07,26.8 22.17,26.7
  Top 1.27: R1.1 22.17,28.9 22.17,26.7 R2.2
  Bottom 1.27: v19.45,26.8 15.65,30.6 8.55,30.6 v8.25,30.3
N$3
  Top 1.27: C4.1 1.98,32.03 2.75,32.8 8.46,32.8 IC1.4
N$4
  Top 1.27: C5.2 10.96,26.49 IC1.1
N$5
  Top 1.27: C5.1 10.96,20.67 NR10050T100M.1 3.77,20.92 D2.1 3.77,26.98 IC1.8
N$6  (via drill 0.35)
  Top 0.8: IC1.6 5.29,30.16 v6.45,29 | v12.15,19.6 13.64,21.09 C10.1
  Top 1.27: C9.1 C10.1
  Bottom 1.27: v6.45,29 9.15,26.3 9.15,22.6 v12.15,19.6
N$8
  Top 1.27: C9.2 16.44,26.26 R3.2
N$9  (via drill 0.35)
  Top 0.8: IC2.3 31.93,29.64 | v45.35,26.6 46.9,26.6 47,26.5
  Top 0.813: 31.93,29.64 v31.93,30.27
  Top 1.27: R6.2 47,25 47,26.5 R5.1
  Bottom 1.27: v45.35,26.6 41.55,30.4 32.06,30.4 v31.93,30.27
N$10
  Top 1.27: LED1.A 24.38,11.18 R4.1
N$11  (via drill 0.35)
  Top 0.8: IC1.5 5.92,31.43 v5.95,31.4
  Bottom 1.27: 3296W-1-103RLF.2 16.77,14.8 13.45,14.8 5.03,23.22 5.03,30.48 v5.95,31.4
N$13
  Top 1.27: C14.1 26.05,31.9 26.75,32.6 32.07,32.6 IC2.4
N$14
  Top 1.27: C15.2 35.06,25.8 IC2.1
N$15
  Top 1.27: C15.1 36,21.95 NR10050T100M1.1 31.35,18.4 28.45,21.3 D1.1 28.45,26.98 IC2.8
N$17  (via drill 0.35)
  Top 0.8: IC2.6 29.21,29.64 v30.35,28.5 | v38.05,26.3 C20.1
  Top 1.27: C20.1 C19.1
  Bottom 1.27: v38.05,26.3 35.85,28.5 v30.35,28.5
N$18
  Top 1.27: C19.2 R7.2
N$19
  Top 1.27: LED2.A 49.25,11.2 R8.1
N$20  (via drill 0.35)
  Top 0.8: IC2.5 v30.05,30.91 v30.05,30.9
  Bottom 1.27: 3296W-1-103RLF1.2 37.4,14.85 28.75,23.5 28.75,29.6 v30.05,30.9
N$21  (via drill 0.35)
  Top 0.8: IC3.3 56.91,30.14 v56.35,30.7 | v69.85,26.9 72.65,26.9
  Top 1.27: R9.1 72.65,26.9 R10.2
  Bottom 1.27: v69.85,26.9 66.05,30.7 v56.35,30.7
N$23
  Top 1.27: C24.1 50.6,31.95 51.55,32.9 56.97,32.9 IC3.4
N$24
  Top 1.27: C25.2 58.46,27.34 IC3.1
N$25
  Top 1.27: C25.1 60.55,21.4 NR10050T100M2.1 52.5,22.65 D3.1 52.5,27.06 IC3.8
N$27  (via drill 0.35)
  Top 0.8: IC3.6 53.81,30.14 v55.45,28.5 | v62.35,24 64.45,24 C29.1
  Top 1.27: C29.1 C30.1
  Bottom 1.27: v62.35,24 59.95,24 v55.45,28.5
N$28
  Top 1.27: C29.2 R11.2
N$29
  Top 1.27: LED3.A 74,11.6 R12.1
N$30  (via drill 0.35)
  Top 0.8: IC3.5 v54.84,31.41 v54.85,31.4
  Bottom 1.27: 3296W-1-103RLF2.2 61.85,14.7 53.65,22.9 53.65,30.2 v54.85,31.4
N$31  (via drill 0.35)
  Top 0.8: IC4.3 69.44,46.91 v70.05,46.3 | v55.55,49.1 54.05,47.6 R13.1
  Top 1.27: R14.2 52.6,49 R13.1
  Bottom 1.27: v70.05,46.3 70.05,45.8 69.65,45.4 59.25,45.4 v55.55,49.1
N$33
  Top 1.27: IC4.4 69.58,44.2 75.65,44.2 75.95,44.5 C34.1
N$34
  Top 1.27: C35.2 65.69,49.45 IC4.1
N$35
  Top 1.27: C35.1 68.15,56.2 NR10050T100M3.1 73.2,53.25 D4.1 73.2,49.82 IC4.8
N$37  (via drill 0.35)
  Top 0.8: IC4.6 72.44,46.91 v71.15,48.2 | v62.75,52.9 C39.1
  Top 1.27: C39.1 C40.1
  Bottom 1.27: v71.15,48.2 67.45,48.2 v62.75,52.9
N$38
  Top 1.27: C39.2 R15.2
N$39
  Top 1.27: LED4.A 51.35,64.65 R16.1
N$40  (via drill 0.35)
  Top 0.8: IC4.5 71.61,45.65 v71.55,45.7
  Bottom 0.8: 73.45,46.9 73.05,46.5
  Bottom 1.27: 3296W-1-103RLF3.2 60.8,61.45 73.45,48.8 73.45,46.9 | 73.05,46.5 72.35,46.5 v71.55,45.7
N$41  (via drill 0.35)
  Top 0.61: IC5.3 43.58,46.27 v44.05,45.8
  Top 1.27: R18.2 27.55,47.5 R17.1 28,47.15 v30.15,49.3
  Bottom 1.27: v44.05,45.8 42.66,44.41 32.34,44.41 30.15,46.6 v30.15,49.3
N$43
  Top 1.27: IC5.4 43.48,43.6 48.55,43.6 50.25,45.3 C44.1
N$44
  Top 0.813: C45.2 40.54,50.35 IC5.1
N$45
  Top 1.27: C45.1 43.05,57.15 NR10050T100M4.1 43.05,57.7 D5.1 47.51,51.36 IC5.8
N$47  (via drill 0.35)
  Top 0.813: IC5.6 46.48,46.27 v45.35,47.4 | v37.25,49.4 35.85,49.4 C50.1
  Top 1.27: C49.1 C50.1
  Bottom 1.27: v45.35,47.4 39.25,47.4 v37.25,49.4
N$48
  Top 1.27: C49.2 R19.2
N$49
  Top 1.27: LED5.A 26.35,64.8 R20.1
N$50  (via drill 0.35)
  Top 0.813: IC5.5 v45.65,44.99 v45.65,45
  Bottom 1.27: 3296W-1-103RLF4.2 37.45,61.1 47.45,51.1 47.45,45.8 46.65,45 v45.65,45
N$51  (via drill 0.35)
  Top 0.8: IC6.3 17.48,46.47 v17.85,46.1 | v4.25,47.8 R21.1
  Top 1.27: R21.1 2.7,52 R22.2
  Bottom 1.27: v17.85,46.1 4.35,46.1 4.25,46.2 v4.25,47.8
N$53
  Top 1.27: IC6.4 16.66,45.2 17.95,43.9 22.4,43.9 C54.1
N$54
  Top 1: C55.2 15.35,49.01 IC6.1
N$55
  Top 1.27: C55.1 14.2,53.6 NR10050T100M5.1 18.55,55.45 D6.1 21.8,49.54 IC6.8
N$57  (via drill 0.35)
  Top 0.8: IC6.6 19.79,46.47 18.45,47.8 v18.45,48.9 | v13.05,49.1 12.65,49.1 11.65,50.1 C60.1
  Top 1.27: C59.1 C60.1
  Bottom 1.27: v18.45,48.9 13.25,48.9 v13.05,49.1
N$58
  Top 1.27: R23.2 8.25,54.9 C59.2
N$59
  Top 1.27: LED6.A 2.15,66.55 R24.1
N$60  (via drill 0.35)
  Top 1: IC6.5 v19.55,45.2
  Bottom 1.27: 3296W-1-103RLF5.2 20.15,51.65 20.15,45.8 v19.55,45.2
OUT1+
  pour Top: 48.05,0 48.05,5.1 47.25,5.9 44.65,5.9 43.75,6.8 43.75,9.1 44.45,9.8 47.45,9.8 47.75,10.1 47.75,19.9 47.45,20.2 44.25,20.2 43.85,19.8 43.85,14.2 43.15,13.5 28.95,13.5 27.95,12.5 27.95,8.3 28.85,7.4 29.05,7.2 31.45,7.2 31.65,7 38.65,0
OUT2+
  pour Top: 72.15,0.1 72.15,5.5 71.65,6 71.35,6.3 69.55,6.3 69.05,6.8 69.05,9.5 69.85,10.3 72.25,10.3 72.35,10.4 72.35,20 68.95,20 68.65,19.7 68.65,13.5 68.25,13.1 52.95,13.1 52.45,12.6 52.45,7.5 53.05,6.9 57.85,6.9 59.75,5 59.75,4.7 59.75,0.5 60.25,0 72.05,0
OUT3+
  pour Top: 51.55,75.4 51.55,70.9 52.65,69.8 53.55,68.9 55.15,68.9 55.65,68.4 55.65,66.4 55.15,65.9 53.15,65.9 52.75,65.5 52.75,56.8 53.25,56.3 55.25,56.3 56.55,57.6 56.55,61.9 57.45,62.8 73.55,62.8 74.35,63.6 74.35,66.6 72.25,68.7 66.95,68.7 60.25,75.4
OUT4+
  pour Top: 27.75,75.5 27.75,70 28.35,69.4 30.15,69.4 30.55,69 30.55,66.4 30.25,66.1 28.05,66.1 27.85,65.9 27.85,56.2 28.15,55.9 30.35,55.9 30.75,56.3 31.15,56.7 31.15,62.3 31.55,62.7 34.85,62.7 46.45,62.7 46.95,63.2 47.35,63.6 47.35,67.5 45.95,68.9 42.65,68.9 40.25,68.9 33.65,75.5
OUT5+
  pour Top: 0.15,75.4 0.15,69.2 0.85,68.5 5.55,68.5 6.35,67.7 6.35,65.8 6.05,65.5 4.45,65.5 3.55,64.6 3.55,63.2 3.55,55.9 4.05,55.4 6.25,55.4 6.65,55.8 7.15,56.3 7.15,62.5 8.25,63.6 21.05,63.6 22.35,64.9 22.35,67.5 21.05,68.8 18.85,68.8 13.35,68.8 12.25,69.9 10.95,71.2 10.95,75.4
OUT+
  pour Top: 23.15,0 23.15,4.5 22.15,5.5 21.85,5.8 20.15,5.8 18.95,7 18.95,9 19.95,10 22.45,10 22.95,10.5 22.95,19.4 22.55,19.8 20.25,19.8 18.85,18.4 18.85,14.1 18.15,13.4 15.15,13.4 3.85,13.4 2.25,11.8 2.25,7.3 3.35,6.2 3.65,5.9 8.35,5.9 14.25,0